# EAGLE design LB_BIT_o5_DCMOTOR-v03(rev1) (EAGLE 6.6.0)
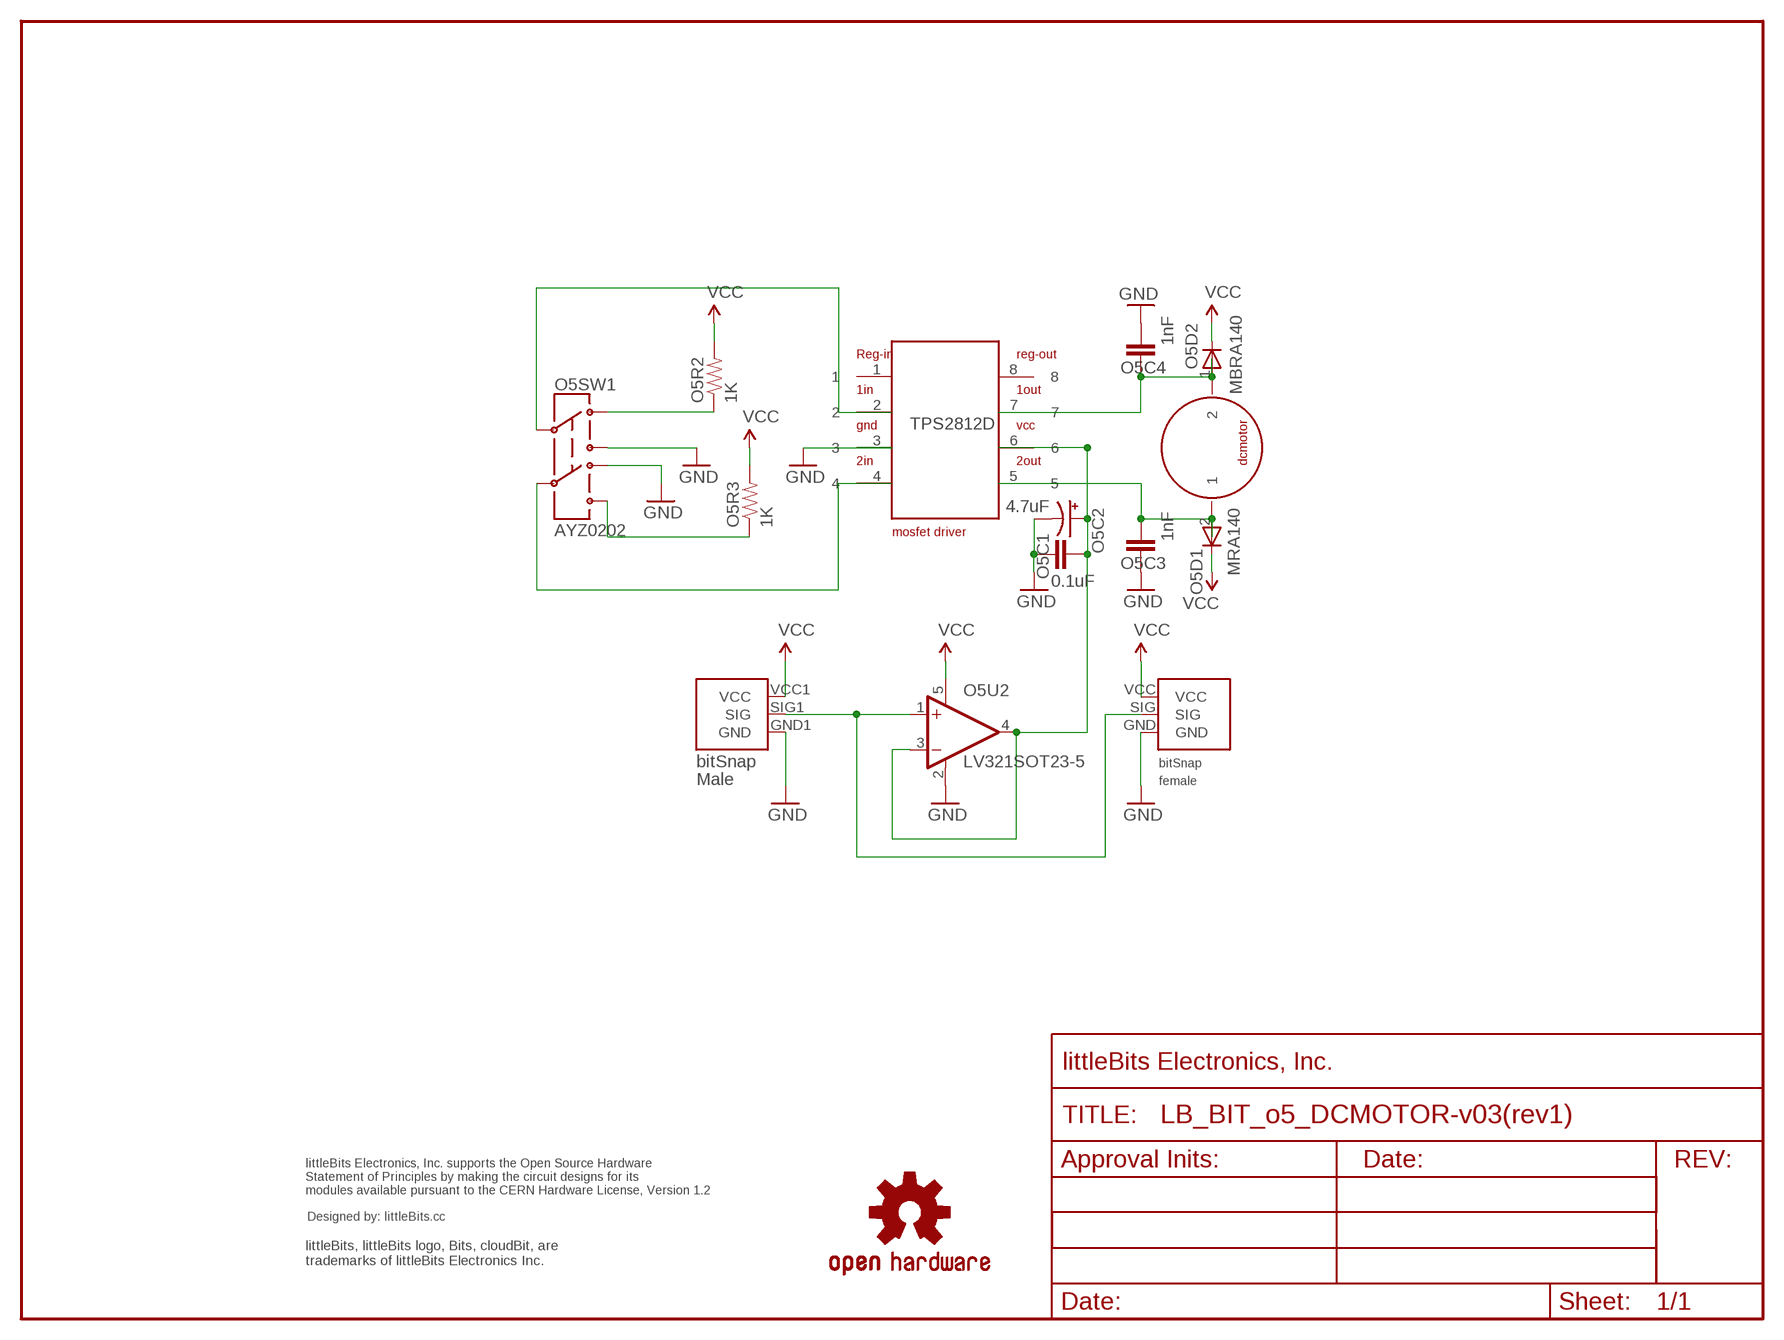
[diagram p0: schematic, sheet 1]

## Parts
O5BSF1  BITSNAP_V03_FEMALE  [BITSNAP_V03_FEMALE]
O5BSM1  BITSNAP_V03_MALE  [BITSNAP_V03_MALE]
O5C1  0.1uF  CAP0603-CAP  [0603-CAP]
O5C2  4.7uF  CAP_POL1206  [EIA3216]
O5C3  1nF  CAP0603-CAP  [0603-CAP]
O5C4  1nF  CAP0603-CAP  [0603-CAP]
O5D1  MRA140  DIODESMA  [SMA-DIODE]
O5D2  MBRA140  DIODESMA  [SMA-DIODE]
O5M1  MOTOR-DC-GEARED  [MOTOR-GEARED]
O5R2  1K  RESISTOR0603-RES  [0603-RES]
O5R3  1K  RESISTOR0603-RES  [0603-RES]
O5SW1  AYZ0202  [AYZ0202]
O5U1  TPS2812-SOIC8  [TPS2812]
O5U2  LV321SOT23-5  [SOT23-5]
U$1  OSHWCREDIT  [OSHWCREDIT]
U$2  FRAME-LETTER-OHWOHW  [FABDWG01-OHW]
U$4  OSHW-LOGOL  [OSHW-LOGO-L]

## Nets
GND: O5BSF1.GND O5BSM1.GND1(GND) O5C1.1 O5C2.C(-) O5C3.1 O5C4.2 O5SW1.1 O5SW1.6 O5U1.3 O5U2.2(V-)
N$1: O5BSF1.SIG O5BSM1.SIG1(SIG) O5U2.1(+IN)
N$4: O5R2.1 O5SW1.3
N$5: O5R3.1 O5SW1.4
N$7: O5SW1.5 O5U1.4
N$8: O5SW1.2 O5U1.2
N$9: O5C4.1 O5D2.A O5M1.1 O5U1.7
N$10: O5C3.2 O5D1.A O5M1.2 O5U1.5
SIG: O5C1.2 O5C2.A(+) O5U1.6 O5U2.3(-IN) O5U2.4(OUT)
VCC: O5BSF1.VCC O5BSM1.VCC1(VCC) O5D1.C O5D2.C O5R2.2 O5R3.2 O5U2.5(V+)
Unconnected: O5U1.1 O5U1.8

## Notes on the sheet
- TPS2812D

## Library data of the parts
O5BSF1 = bitSnap:BITSNAP_V03_FEMALE
O5BSM1 = bitSnap:BITSNAP_V03_MALE
O5C1 O5C3 O5C4 = SparkFun:CAP: Capacitor Standard 0603 ceramic capacitor, and 0.1" leaded capacitor.
O5C2 = SparkFun:CAP_POL: Capacitor Polarized These are standard SMD and PTH capacitors. Normally 10uF, 47uF, and 100uF in electrolytic and tantalum varieties. Always verify the external diameter of the through hole cap, it varies with capacity, voltage, and manufacturer. The EIA devices should be standard.
O5D1 O5D2 = LITTLEBITS:DIODE: Diode These are standard reverse protection diodes and small signal diodes. SMA package can handle up to about 1A. SOD-323 can handle about 200mA. What the SOD-323 package when ordering, there are some mfgs out there that are 5-pin packages.
O5M1 = LITTLEBITS:MOTOR-DC-GEARED
O5R2 O5R3 = SparkFun:RESISTOR: Resistor Basic schematic elements and footprints for 0603, 1206, and PTH 1/10th watt (small) resistors.
O5SW1 = SparkFun:AYZ0202: SPDT Slide Switch Simple SMD single-pull double-throw slide switch. Good for less than 350mA power switch, switching UARTs between devices, etc. Spark Fun Electronics SKU : COM-00597
O5U1 = LITTLEBITS:TPS2812-SOIC8
O5U2 = LITTLEBITS:LV321
U$1 = LITTLEBITS:OSHWCREDIT
U$2 = LITTLEBITS:FRAME-LETTER-OHW
U$4 = SparkFun_NEW:OSHW-LOGO: Open Source Hardware Logo This logo indicates the piece of hardware it is found on incorporates a OSHW license and/or adheres to the definition of open source hardware found here: http://freedomdefined.org/OSHW

## Board
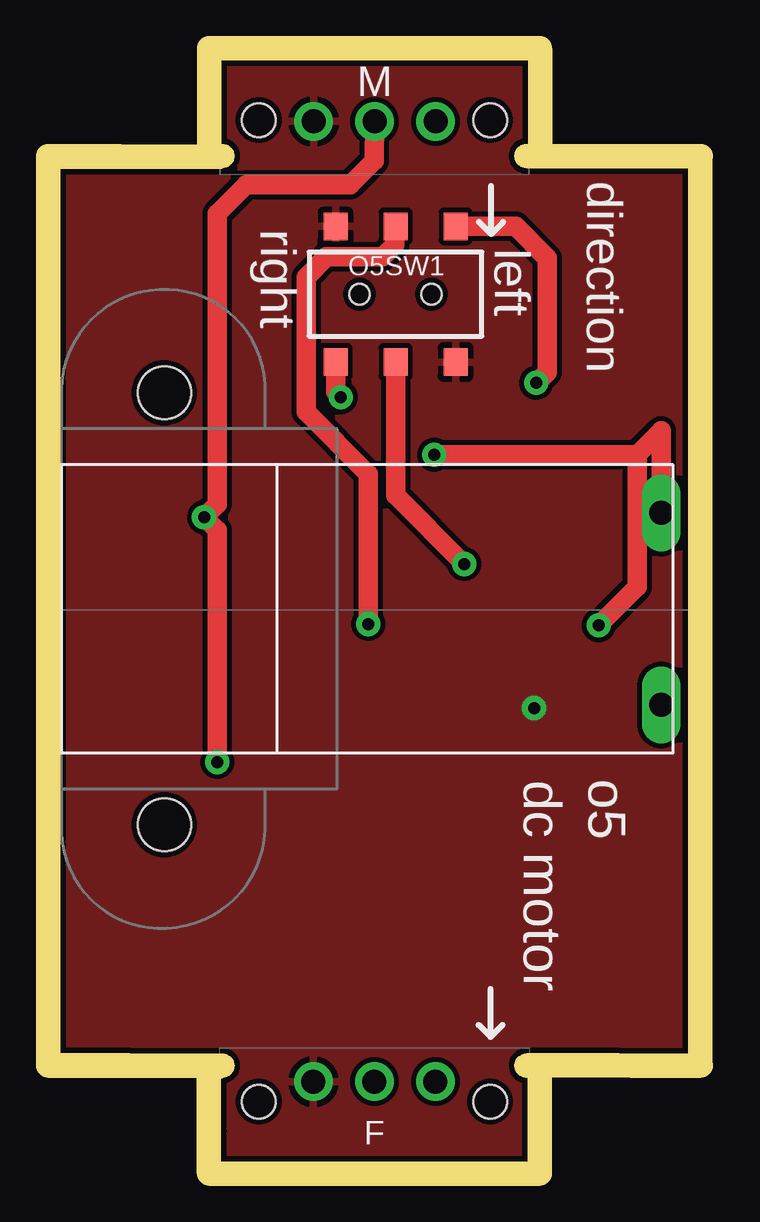
[diagram p1: board, top side]
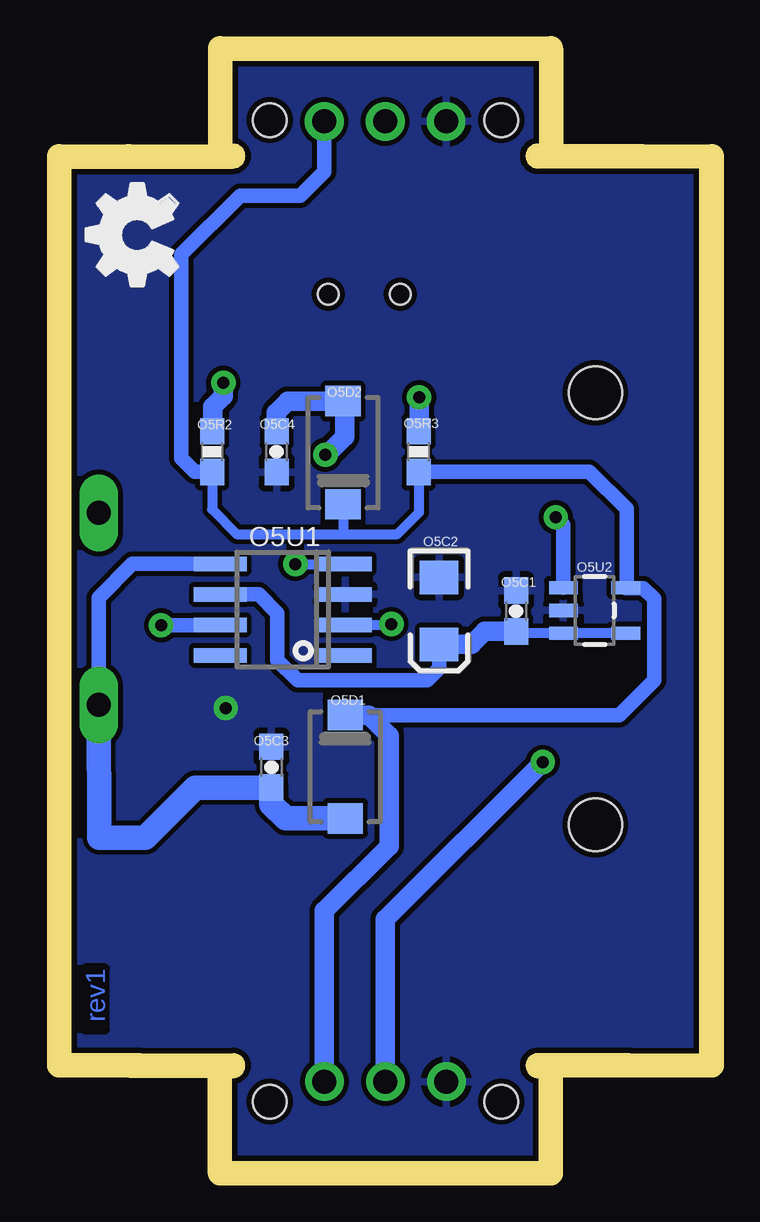
[diagram p2: board, bottom side, seen from below]

Size 26.2 x 45.9 mm. Coordinates in mm from the lower left corner, seen from the top.
Outline: 2.9,4.5 0,4.5 0,41.4 2.95,41.4
Outline: 23.3,4.5 26.2,4.5 26.2,41.4 23.3,41.4
Copper layers (1*16): Top 0.035mm / dielectric 1.5mm / Bottom 0.035mm
Design rules "default": minimum track width 8mil, minimum drill 20mil, track to track 8mil, track to pad 8mil, pad to pad 8mil, via to via 8mil, smd to smd 8mil, copper to edge 10mil, drill to drill 8mil, minimum pad ring 12mil, minimum via ring 10mil, stop-mask expansion 4mil, vias tented up to drill 25mil, thermal gap 10mil
Milling: 6 lines

### Footprints (pad centres in the part's own frame; a part is rotated, then mirrored left to right if it is on the bottom)
BITSNAP_V03_FEMALE = drill 1: GND 3.91,3.33; SIG 6.45,3.33; VCC 8.99,3.33 | hole 1.4: 1.63,2.5; 11.27,2.5
BITSNAP_V03_MALE = drill 1: GND1 8.98,2.56; SIG1 6.44,2.56; VCC1 3.9,2.56 | hole 1.4: 11.27,2.5; 1.63,2.5
0603-CAP = smd 1.1 x 1: 1 -0.85,0; 2 0.85,0
EIA3216 = smd 1.4 x 1.6: A 1.4,0; C -1.4,0
SMA-DIODE = smd 1.27 x 1.47: A -2.15,0; C 2.15,0
MOTOR-GEARED = drill 1 long: 1 10,0.5; 2 2,0.5 | hole 2.2: -3,21.2; 15,21.2
0603-RES = smd 1.1 x 1: 1 -0.85,0; 2 0.85,0
AYZ0202 = smd 1 x 1.15: 1 -2.5,2.825; 2 0,2.825; 3 2.5,2.825; 4 -2.5,-2.825; 5 0,-2.825; 6 2.5,-2.825 | hole 0.85: 1.5,0; -1.5,0
TPS2812 = smd 0.6 x 2.2: 1 -1.905,-2.6; 2 -0.635,-2.6; 3 0.635,-2.6; 4 1.905,-2.6; 5 1.905,2.6; 6 0.635,2.6; 7 -0.635,2.6; 8 -1.905,2.6
SOT23-5 = smd 0.55 x 1.2: 1 -0.95,-1.3; 2 0,-1.3; 3 0.95,-1.3; 4 0.95,1.3; 5 -0.95,1.3

### Placement (x,y rotation side)
O5BSF1  6.65,0 0 top
O5BSM1  19.55,45.9 180 top
O5C1  7.66,22.94 270 bottom
O5C2  10.87,22.94 270 bottom
O5C3  17.85,16.43 270 bottom
O5C4  17.64,29.58 270 bottom
O5D1  14.78,16.45 90 bottom
O5D2  14.87,29.54 270 bottom
O5M1  25.55,17.03 90 top
O5R2  20.32,29.58 270 bottom
O5R3  11.72,29.58 270 bottom
O5SW1  13.98,36.14 0 top
O5U1  17.38,23 90 bottom
O5U2  4.38,22.96 270 bottom
U$1  -22.85,-31.15 0 top  (outside the outline)
U$2  0.05,0 0 top
U$4  36.45,-36.08 0 top  (outside the outline)
U$8  [OSHW_FILLX150_NOTEXT]  21.76,35.66 0 top

### Tracks (layer width: path | path; a pad name or v marks a point on that pad's centre or on a via)
GND  (via drill 0.5)
  Top 0.813: 11.45,39 O5SW1.1
  other vias: 19.75,18.9
  pour Bottom: 0,0 0,45.9 26.2,45.9 26.2,0
  pour Top: 0,0 0,45.9 26.2,45.9 26.2,0
N$1  (via drill 0.5)
  Top 0.813: O5BSM1.SIG1 13.1,41.7 12.1,40.7 7.75,40.7 6.55,39.5 6.55,27.4 v6,26.85 6.55,26.3 v6.55,16.65
  Bottom 0.61: O5U2.1 5.68,26.53 v6,26.85
  Bottom 0.813: O5BSF1.SIG 13.1,10.1 v6.55,16.65
N$4  (via drill 0.5)
  Top 0.813: O5SW1.3 18.98,38.97 20.3,37.65 20.3,32.9 v19.85,32.45
  Bottom 0.813: v19.85,32.45 19.85,31.9 20.3,31.45 20.3,30.45 O5R2.1
N$5  (via drill 0.5)
  Top 0.813: O5SW1.4 11.48,32.07 v11.7,31.85
  Bottom 0.305: 11.7,30.65 O5R3.1
  Bottom 0.813: v11.7,31.85 11.7,30.65
N$7  (via drill 0.5)
  Top 0.813: O5SW1.5 13.98,27.77 v16.85,24.9
  Bottom 0.406: v16.85,24.9 O5U1.4
N$8  (via drill 0.5)
  Top 0.406: 13.95,38.93 O5SW1.2
  Top 0.813: v12.85,22.4 12.85,28.65 10.25,31.25 10.25,36.85 11.1,37.7 13.45,37.7 13.95,38.2 13.95,38.93
  Bottom 0.406: O5U1.2 12.89,22.36 v12.85,22.4
N$9  (via drill 0.5)
  Top 0.813: O5M1.1 25.05,30.45 24.05,29.45 | 24.05,29.45 v15.6,29.45 | 24.05,29.45 24.05,23.95 v22.45,22.35
  Bottom 0.61: v22.45,22.35 20,22.35 O5U1.7
  Bottom 0.813: O5C4.1 17.65,30.44 17.65,31.2 17.16,31.69 O5D2.A 14.8,31.62 14.8,30.2 15.55,29.45 v15.6,29.45
N$10
  Bottom 0.61: O5U1.5 23.64,24.91 25.05,23.5 O5M1.2
  Bottom 1.016: O5D1.A 17.25,14.3 17.85,14.9 O5C3.2 21.02,15.59 23.1,13.5 25.02,13.5 O5M1.2
SIG
  Bottom 0.406: O5U2.4 O5U2.3 7.66,22.02 O5C1.2
  Bottom 0.61: O5U1.6 18.39,23.64 17.6,22.85 17.6,20.9 16.75,20.05 11.35,20.05 10.85,20.55 10.85,21.52 O5C2.A
  Bottom 0.813: O5C1.2 8.96,22.09 9.5,21.55 O5C2.A
VCC
  Bottom 0.305: 11.7,28.75 O5R3.2
  Bottom 0.406: O5R2.2 20.32,27.17 19.3,26.15 14.95,26.15 | 14.95,26.15 12.6,26.15 11.7,27.05 11.7,28.71 O5R3.2 | O5D2.C 14.87,26.23 14.95,26.15
  Bottom 0.61: 11.7,28.75 4.6,28.75 3.05,27.2 3.05,23.95 O5U2.5 3.07,23.9 2.35,23.9 1.9,23.45 1.9,20.05 3.35,18.6 O5D1.C | O5BSM1.VCC1 15.65,41.25 16.65,40.25 19.15,40.25 21.6,37.8 21.6,29.3 21.05,28.75 20.34,28.75 O5R2.2
  Bottom 0.813: O5BSF1.VCC 15.65,10.45 12.95,13.15 12.95,17.75 13.8,18.6 O5D1.C

### Text on the board
Bottom: rev1
tPlace: direction | right | left | dc motor | o5
bNames: O5U1
Milling: 1mm DIA. ROUTER PATH
Reference: TPS2812D